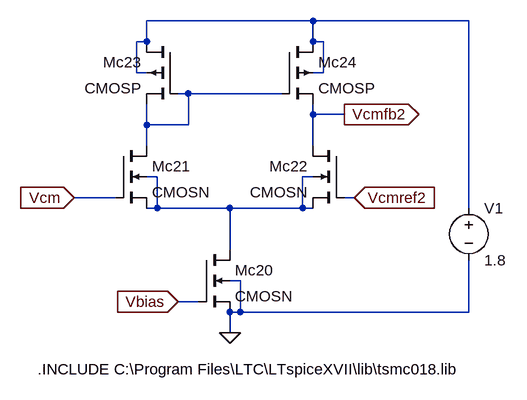
[diagram p0: schematic Stage2CommonModeFeedback.asc]
Stage2CommonModeFeedback.asc, the LTspice schematic file:
Version 4
SHEET 1 1116 680
WIRE 816 -144 560 -144
WIRE 1056 -144 816 -144
WIRE 560 -112 560 -144
WIRE 560 -112 544 -112
WIRE 816 -112 816 -144
WIRE 832 -112 816 -112
WIRE 544 -64 544 -112
WIRE 560 -64 544 -64
WIRE 832 -64 832 -112
WIRE 832 -64 816 -64
WIRE 624 -32 608 -32
WIRE 768 -32 624 -32
WIRE 816 0 816 -16
WIRE 864 0 816 0
WIRE 560 16 560 -16
WIRE 624 16 624 -32
WIRE 624 16 560 16
WIRE 560 48 560 16
WIRE 816 48 816 0
WIRE 576 96 560 96
WIRE 816 96 800 96
WIRE 512 128 448 128
WIRE 880 128 864 128
WIRE 576 144 576 96
WIRE 576 144 560 144
WIRE 688 144 576 144
WIRE 800 144 800 96
WIRE 800 144 688 144
WIRE 816 144 800 144
WIRE 1056 144 1056 -144
WIRE 688 208 688 144
WIRE 704 256 688 256
WIRE 640 288 608 288
WIRE 704 304 704 256
WIRE 704 304 688 304
WIRE 1056 304 1056 224
WIRE 1056 304 704 304
WIRE 688 336 688 304
FLAG 608 288 Vbias
IOPIN 608 288 In
FLAG 448 128 Vcm
IOPIN 448 128 In
FLAG 880 128 Vcmref2
IOPIN 880 128 In
FLAG 864 0 Vcmfb2
IOPIN 864 0 Out
FLAG 688 336 0
SYMBOL voltage 1056 128 R0
WINDOW 123 0 0 Left 2
WINDOW 39 0 0 Left 2
SYMATTR InstName V1
SYMATTR Value 1.8
SYMBOL pmos4 608 -112 M0
SYMATTR InstName Mc23
SYMATTR Value CMOSP
SYMATTR Value2 l=0.18µ w=4.14µ ad=1.4904p as=1.4904p pd=9µ ps=9µ
SYMBOL nmos4 512 48 R0
SYMATTR InstName Mc21
SYMATTR Value CMOSN
SYMATTR Value2 l=0.18µ w=1.035µ ad=0.3726p as=0.3726p pd=2.79µ ps=2.79µ
SYMBOL nmos4 640 208 R0
SYMATTR InstName Mc20
SYMATTR Value CMOSN
SYMATTR Value2 l=0.18µ w=2.07µ ad=0.7452p as=0.7452p pd=4.86µ ps=4.86µ
SYMBOL nmos4 864 48 M0
SYMATTR InstName Mc22
SYMATTR Value CMOSN
SYMATTR Value2 l=0.18µ w=1.035µ ad=0.3726p as=0.3726p pd=2.79µ ps=2.79µ
SYMBOL pmos4 768 -112 R0
SYMATTR InstName Mc24
SYMATTR Value CMOSP
SYMATTR Value2 l=0.18µ w=4.14µ ad=1.4904p as=1.4904p pd=9µ ps=9µ
TEXT 392 392 Left 2 !.INCLUDE C:\\Program Files\\LTC\\LTspiceXVII\\lib\\tsmc018.lib

The netlist it stands for:
* Stage2CommonModeFeedback.asc
V1 N001 0 1.8
Mc23 N001 N002 N002 N001 CMOSP l=0.18µ w=4.14µ ad=1.4904p as=1.4904p pd=9µ ps=9µ
Mc21 N002 Vcm N003 N003 CMOSN l=0.18µ w=1.035µ ad=0.3726p as=0.3726p pd=2.79µ ps=2.79µ
Mc20 N003 Vbias 0 0 CMOSN l=0.18µ w=2.07µ ad=0.7452p as=0.7452p pd=4.86µ ps=4.86µ
Mc22 Vcmfb2 Vcmref2 N003 N003 CMOSN l=0.18µ w=1.035µ ad=0.3726p as=0.3726p pd=2.79µ ps=2.79µ
Mc24 N001 N002 Vcmfb2 N001 CMOSP l=0.18µ w=4.14µ ad=1.4904p as=1.4904p pd=9µ ps=9µ
.model NMOS NMOS
.model PMOS PMOS
.lib standard.mos
.INCLUDE C:\Program Files\LTC\LTspiceXVII\lib\tsmc018.lib
.backanno
.end